# EAGLE schematic mixer-L-band-MAC-24+ (EAGLE 9.5.1)
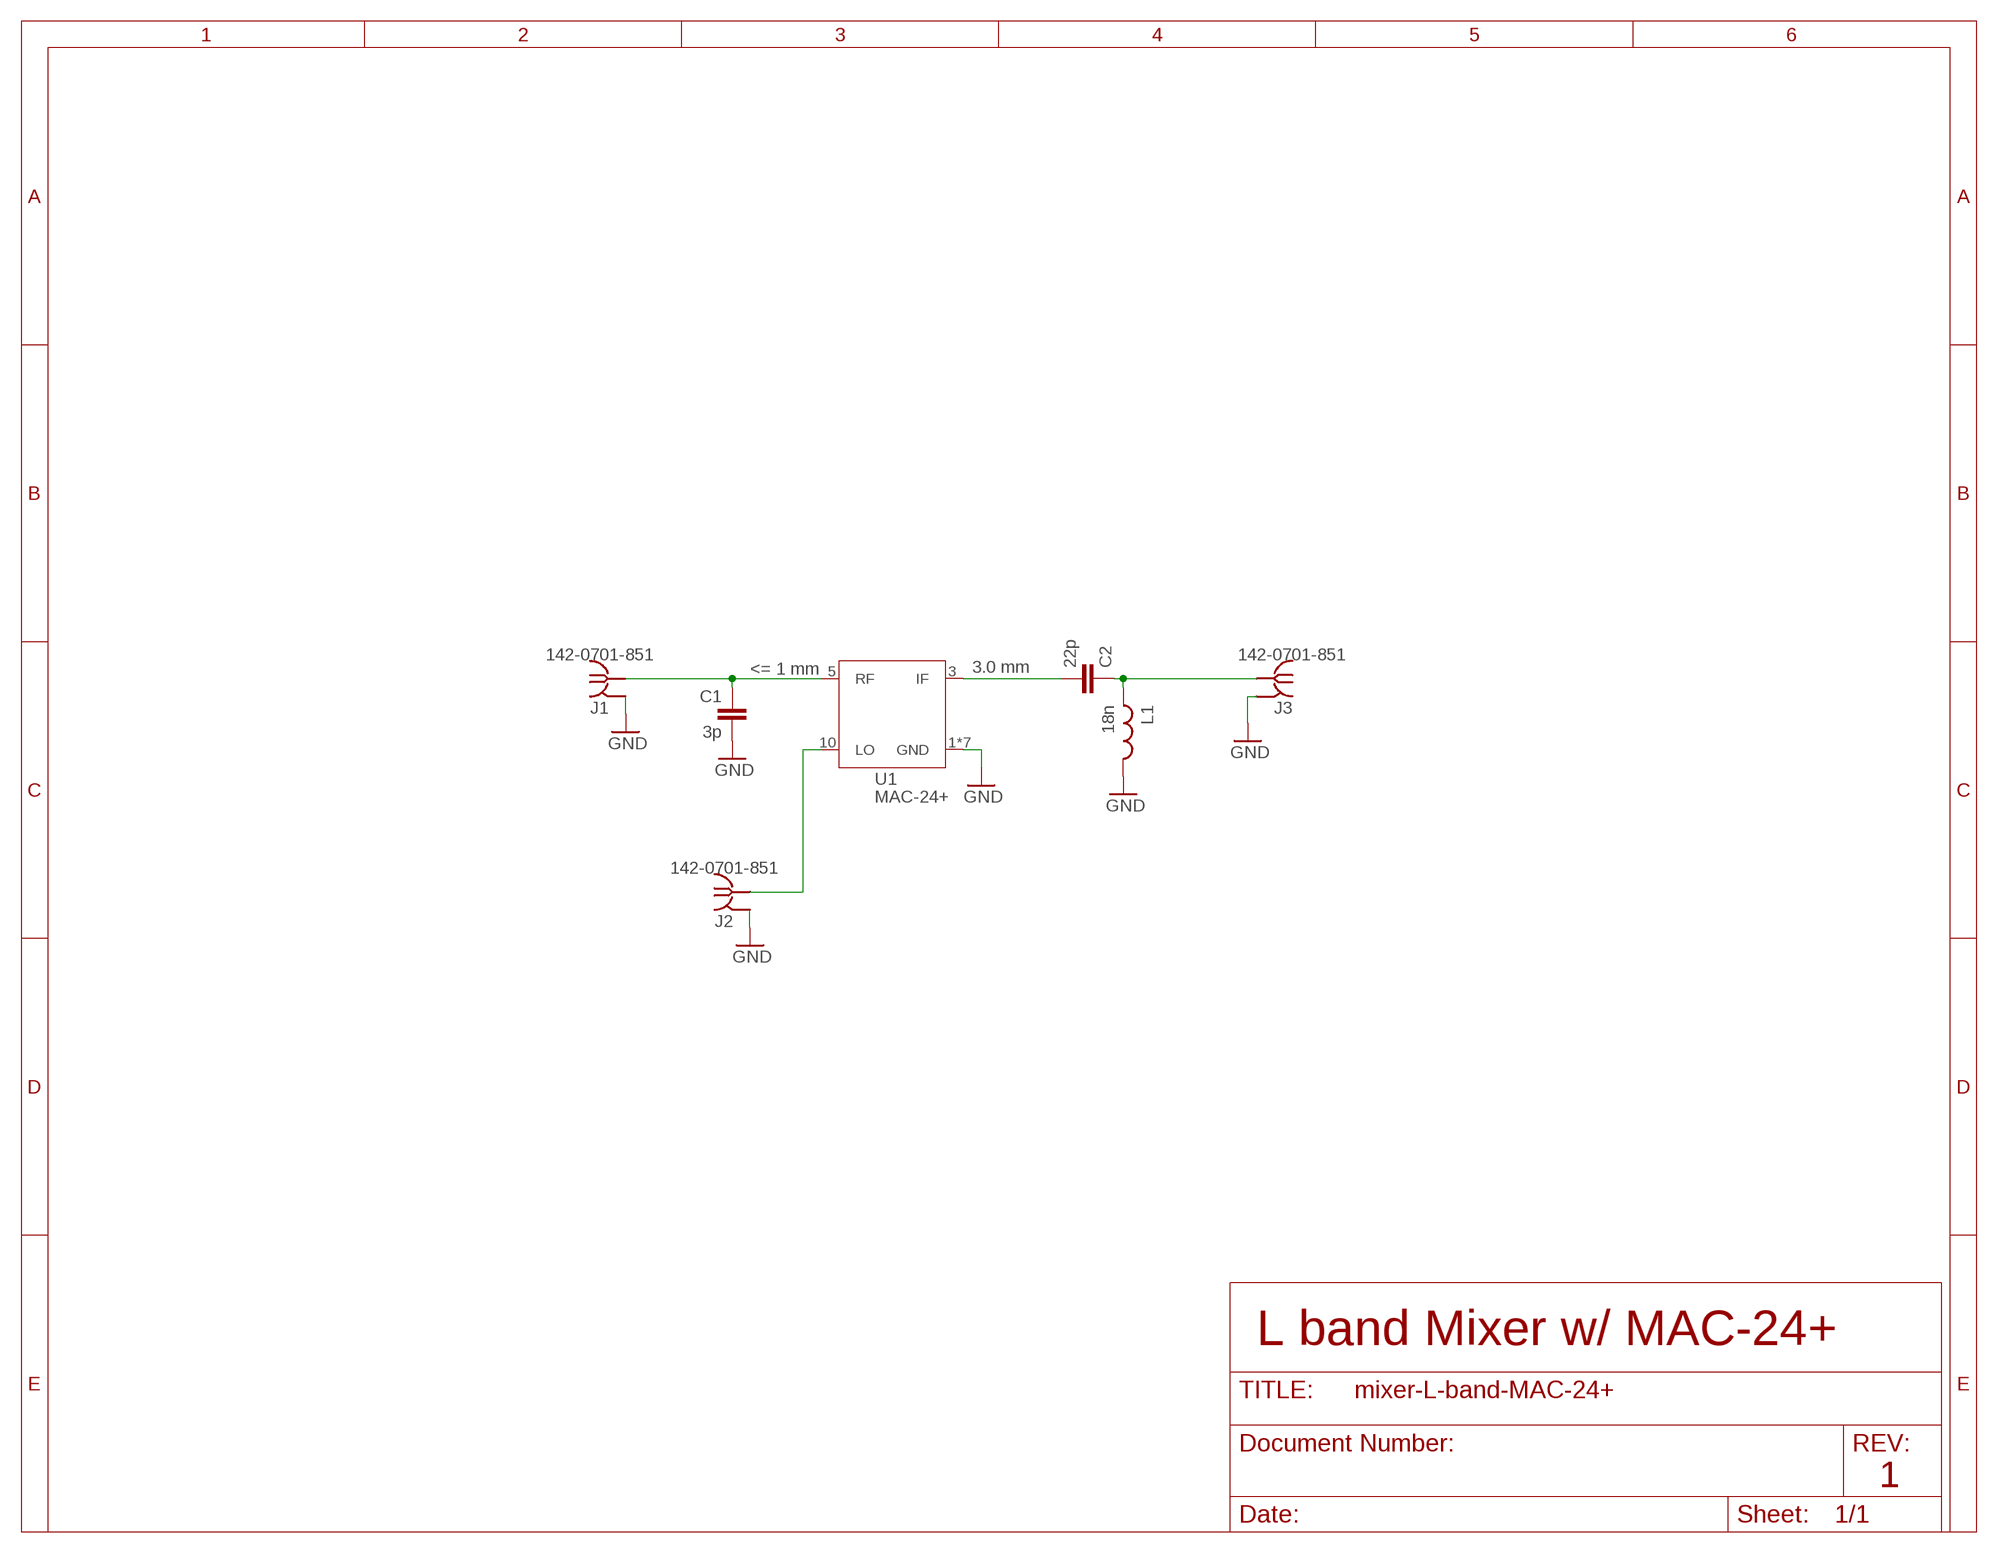
[diagram p0: schematic, sheet 1]

## Parts
C1  3p  C-EU0402-B-NOSILK  [.0402-B-NOSILK]
C2  22p  C-EU0402-B-NOSILK  [.0402-B-NOSILK]
J1  142-0701-851  [142-0701-851]
J2  142-0701-851  [142-0701-851]
J3  142-0701-851  [142-0701-851]
L1  18n  L-US0402-B-NOSILK  [.0402-B-NOSILK]
U1  MAC-24+  [MAC-24+]

## Nets
GND: C1.2 J1.GND1(GND) J1.GND2(GND) J1.GND3(GND) J1.GND4(GND) J2.GND1(GND) J2.GND2(GND) J2.GND3(GND) J2.GND4(GND) J3.GND1(GND) J3.GND2(GND) J3.GND3(GND) J3.GND4(GND) L1.2 U1.1(GND) U1.2(GND) U1.4(GND) U1.6(GND) U1.7(GND) U1.8(GND) U1.9(GND)
N$1 [RF1]: C2.2 U1.3(IF)
N$2: J2.RF1(RF) U1.10(LO)
N$3: C1.1 J1.RF1(RF) U1.5(RF)
N$4: C2.1 J3.RF1(RF) L1.1

## Notes on the sheet
- <= 1 mm | 3.0 mm
- L band Mixer w/ MAC-24+
- 1

## Library data of the parts
C1 C2 = oresat-rcl:C-EU: CAPACITOR, European symbol
J1-J3 = J-Cinch-142-0701-851-SMA-end-launch:142-0701-851: SMA Jack 50Ω - End Launch Source: Datasheet <https://belfuse.com/resources/productinformations/cinchconnectivitysolutions/johnson/pi-ccs-john-142-0701-851.pdf>
L1 = oresat-rcl:L-US: INDUCTOR, American symbol
U1 = U-MiniCirc-Mac-24+-mixer:MAC-24+: RF Mixer, Diode Ring, 0.3 - 12 GHz

## Net classes
1 RF1: clearance 0.5 mm
2 RF2: clearance 0.7 mm